# Altium schematic sheet PSAT.SchDoc
size 381 x 241 mm; SheetNumber: 1; SheetTotal: 1
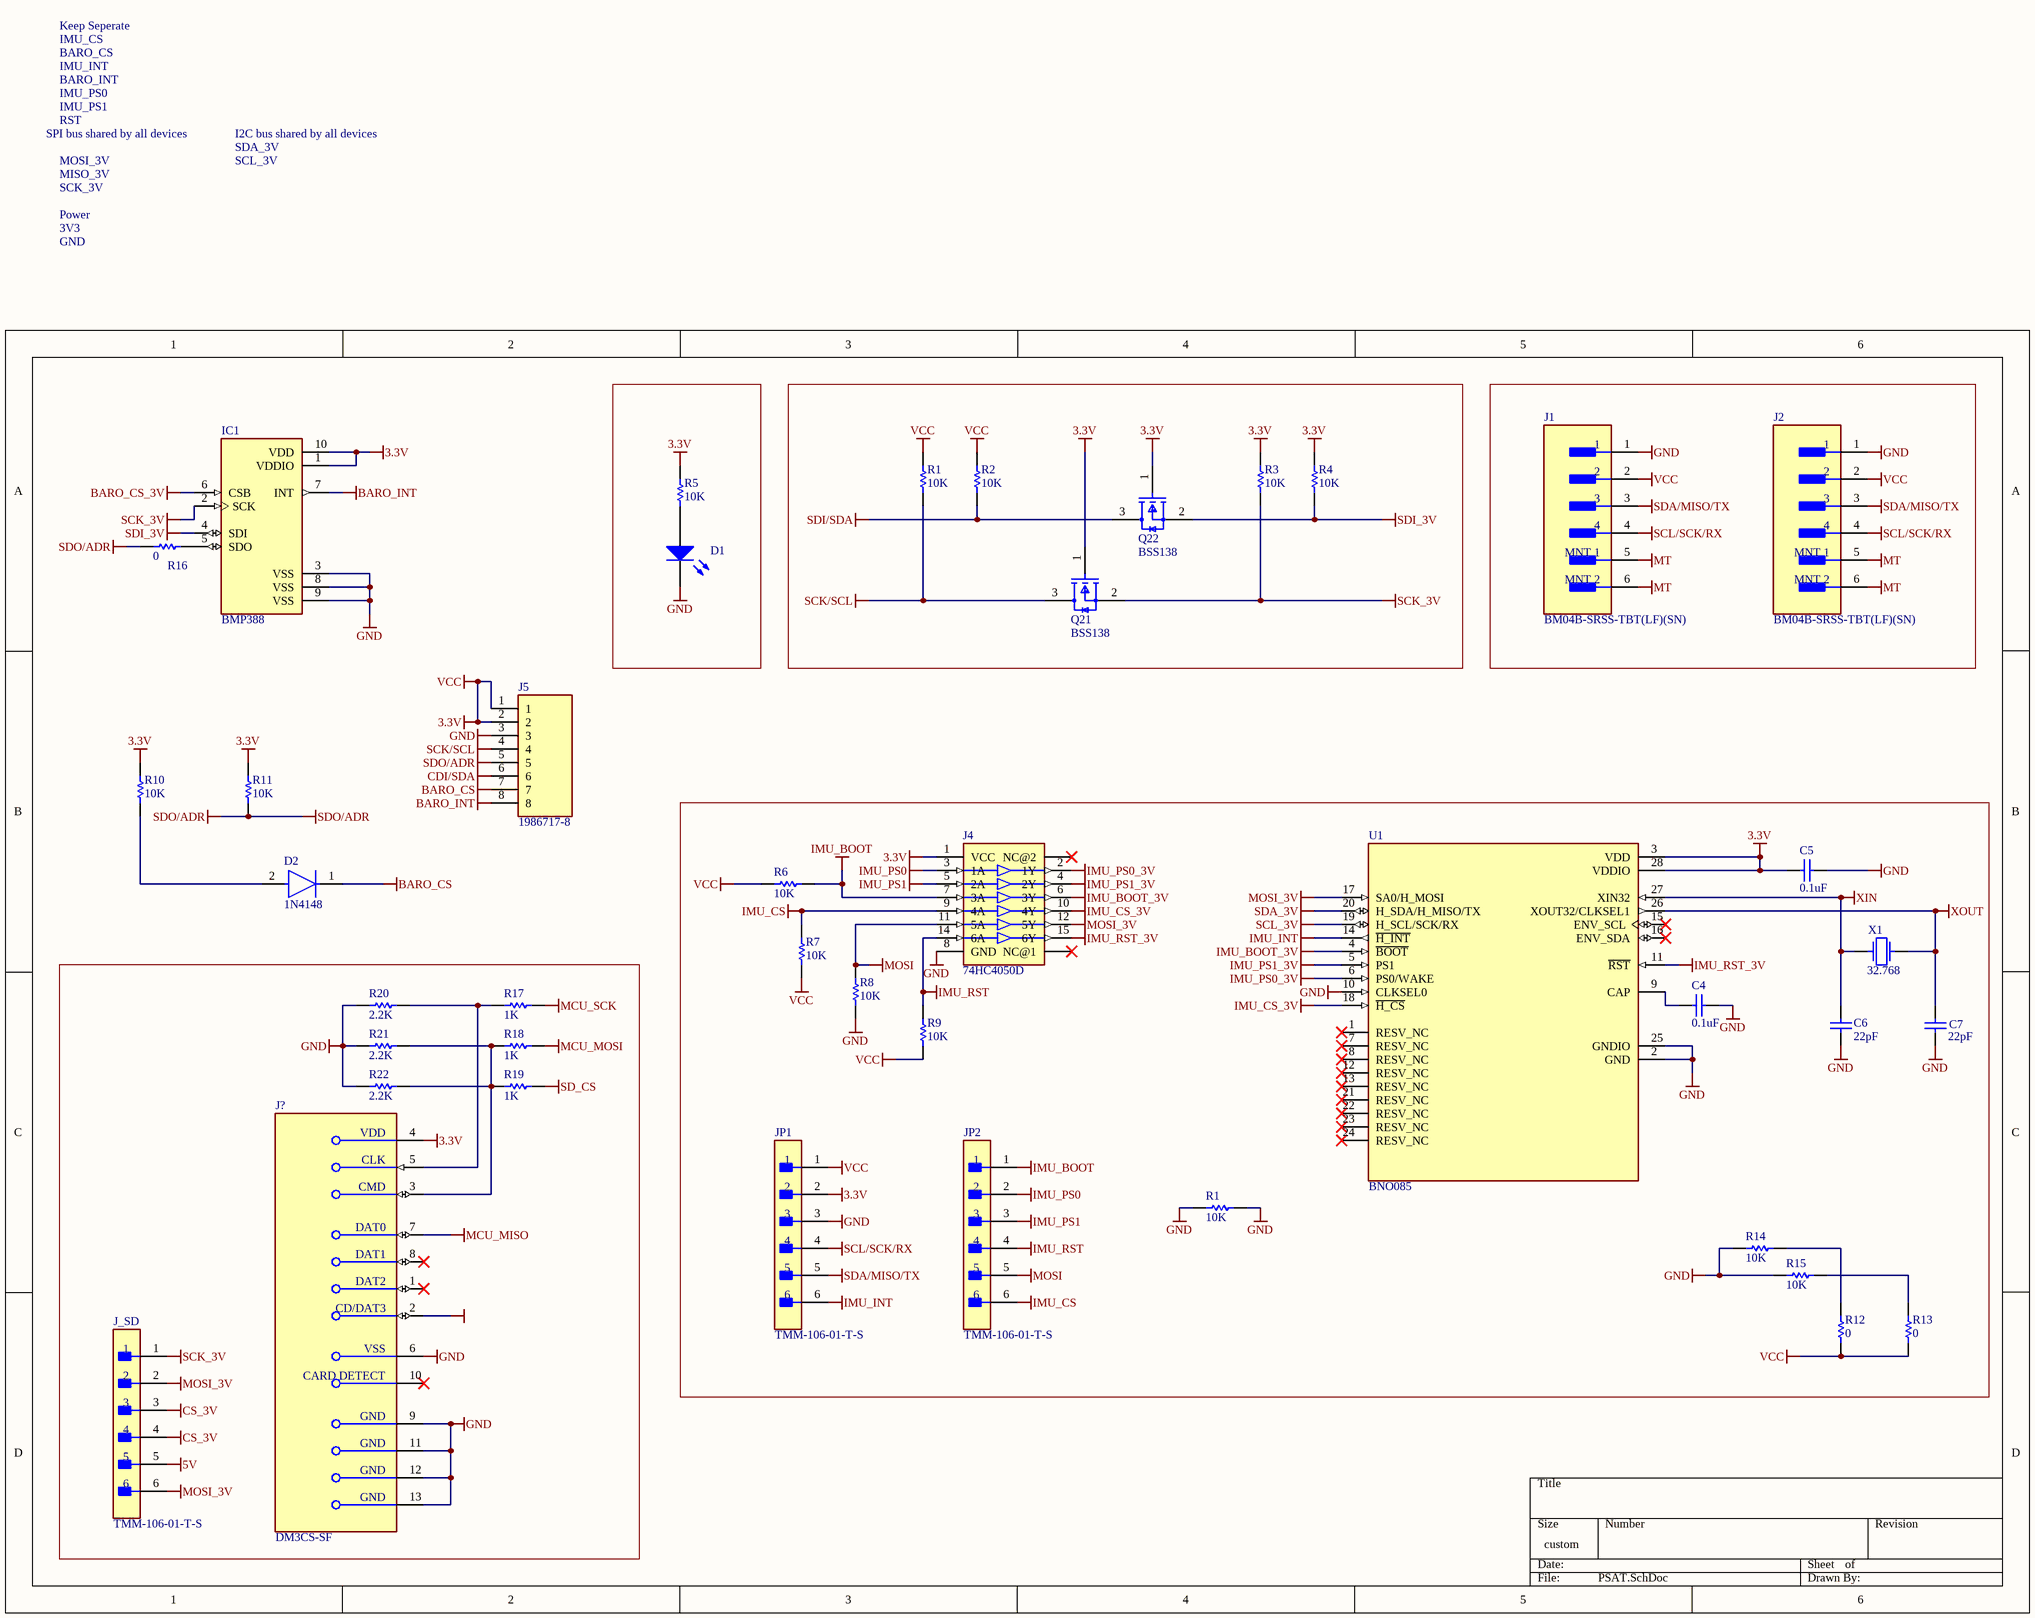
[diagram p0: PSAT.SchDoc]

## Parts
(Parts that share a designator on the sheet are numbered #1, #2 ... from top to bottom, then left to right.)
C4  value 0.1uF  (hidden comment: Capacitor)
C5  C5: 0.1uF  (hidden comment: Capacitor)
C6  C5: 22pF  (hidden comment: Capacitor)
C7  C5: 22pF  (hidden comment: Capacitor)
D1  Light-Emitting Diode  (value not drawn)
D2  1N4148  [FP-017AG-MFG]
IC1  BMP388  [PQFN50P200X200X80-10N]
J1  BM04B-SRSS-TBT(LF)(SN)  [FP-BM04B-SRSS-TBT_LF_SN-MFG]
J2  BM04B-SRSS-TBT(LF)(SN)  [FP-BM04B-SRSS-TBT_LF_SN-MFG]
J4  74HC4050D  [SO16]
J5  1986717-8  [TE_1986717-8]
J?  DM3CS-SF  [FP-DM3CS-SF-MFG]
J_SD  TMM-106-01-T-S  [FP-TMM-106-01-T-S-MFG]
JP1  TMM-106-01-T-S  [FP-TMM-106-01-T-S-MFG]
JP2  TMM-106-01-T-S  [FP-TMM-106-01-T-S-MFG]
Q21  BSS138  [FP-318-08-IPC_B]
Q22  BSS138  [FP-318-08-IPC_B]
R1#1  value 10K  (hidden comment: Resistor)
R1#2  value 10K  (hidden comment: Resistor)
R2  value 10K  (hidden comment: Resistor)
R3  value 10K  (hidden comment: Resistor)
R4  value 10K  (hidden comment: Resistor)
R5  value 10K  (hidden comment: Resistor)
R6  value 10K  (hidden comment: Resistor)
R7  value 10K  (hidden comment: Resistor)
R8  value 10K  (hidden comment: Resistor)
R9  value 10K  (hidden comment: Resistor)
R10  value 10K  (hidden comment: Resistor)
R11  value 10K  (hidden comment: Resistor)
R12  value 0  (hidden comment: Resistor)
R13  value 0  (hidden comment: Resistor)
R14  value 10K  (hidden comment: Resistor)
R15  value 10K  (hidden comment: Resistor)
R16  value 0  (hidden comment: Resistor)
R17  value 1K  (hidden comment: Resistor)
R18  value 1K  (hidden comment: Resistor)
R19  value 1K  (hidden comment: Resistor)
R20  value 2.2K  (hidden comment: Resistor)
R21  value 2.2K  (hidden comment: Resistor)
R22  value 2.2K  (hidden comment: Resistor)
U1  BNO085  [IC_BNO085]
X1  F0: 32.768  (hidden comment: Crystal)

## Nets
3.3V: C5.2 IC1.1(VDDIO) IC1.10(VDD) J1.2 J2.2 J4.1(VCC) J5.1 J5.2 J?.4(VDD) JP1.1 JP1.2 Q21.1(G) Q22.1(G) R1#1.2 R2.2 R3.2 R4.2 R5.2 R6.1 R7.2 R9.2 R10.2 R11.2 R12.1 R13.1 U1.3(VDD) U1.28(VDDIO)  [also labelled VCC]
5V: J_SD.5
BARO_CS: D2.1(C) J5.7
BARO_CS_3V: IC1.6(CSB)
BARO_INT: IC1.7(INT) J5.8
CDI/SDA: J5.6
CS_3V: J_SD.3 J_SD.4
GND: C4.2 C5.1 C6.1 C7.1 D1.2(K) IC1.3(VSS) IC1.8(VSS) IC1.9(VSS) J1.1 J2.1 J4.8(GND) J5.3 J?.6(VSS) J?.9(GND) J?.11(GND) J?.12(GND) J?.13(GND) JP1.3 R1#2.1 R1#2.2 R8.2 R14.2 R15.2 R20.1 R21.1 R22.1 U1.2(GND) U1.10(CLKSEL0) U1.25(GNDIO)
IMU_BOOT: J4.7(3A) JP2.1 R6.2
IMU_BOOT_3V: J4.6(3Y) U1.4(~{BOOT})
IMU_CS: J4.9(4A) JP2.6 R7.1
IMU_CS_3V: J4.10(4Y) U1.18(~{H_CS})
IMU_INT: JP1.6 U1.14(~{H_INT})
IMU_PS0: J4.3(1A) JP2.2
IMU_PS0_3V: J4.2(1Y) U1.6(PS0/WAKE)
IMU_PS1: J4.5(2A) JP2.3
IMU_PS1_3V: J4.4(2Y) U1.5(PS1)
IMU_RST: J4.14(6A) JP2.4 R9.1
IMU_RST_3V: J4.15(6Y) U1.11(~{RST})
MCU_MISO: J?.7(DAT0)
MCU_MOSI: R18.2
MCU_SCK: R17.2
MOSI: J4.11(5A) JP2.5 R8.1
MOSI_3V: J4.12(5Y) J_SD.2 J_SD.6 U1.17(SA0/H_MOSI)
MT: J1.5(MNT_1) J1.6(MNT_2) J2.5(MNT_1) J2.6(MNT_2)
SCK/SCL: J5.4 Q21.3(D) R1#1.1
SCK_3V: IC1.2(SCK) J_SD.1 Q21.2(S) R3.1
SCL/SCK/RX: J1.4 J2.4 JP1.4
SCL_3V: U1.19(H_SCL/SCK/RX)
SD_CS: R19.2
SDA/MISO/TX: J1.3 J2.3 JP1.5
SDA_3V: U1.20(H_SDA/H_MISO/TX)
SDI/SDA: Q22.3(D) R2.1
SDI_3V: IC1.4(SDI) Q22.2(S) R4.1
SDO/ADR: J5.5 R11.1 R16.2
XIN: C6.2 U1.27(XIN32) X1.1
XOUT: C7.2 U1.26(XOUT32/CLKSEL1) X1.2
NetC4_1: C4.1 U1.9(CAP)
NetD1_1: D1.1(A) R5.1
NetD2_2: D2.2(A) R10.1
NetIC1_5: IC1.5(SDO) R16.1
NetJ?_3: J?.3(CMD) R18.1 R19.1 R21.2 R22.2
NetJ?_5: J?.5(CLK) R17.1 R20.2
NetR12_2: R12.2 R14.1
NetR13_2: R13.2 R15.1

Not connected (* = marked no-connect by the designer): J4 13(NC@1)* 16(NC@2)*; J? 1(DAT2)* 2(CD/DAT3) 8(DAT1)* 10(CARD_DETECT)*; U1 1(RESV_NC)* 7(RESV_NC)* 8(RESV_NC)* 12(RESV_NC)* 13(RESV_NC)* 15(ENV_SCL)* 16(ENV_SDA)* 21(RESV_NC)* 22(RESV_NC)* 23(RESV_NC)* 24(RESV_NC)*

## Notes on the sheet
- Keep Seperate
- IMU_CS
- BARO_CS
- IMU_INT
- BARO_INT
- SPI bus shared by all devices
- IMU_PS0
- IMU_PS1
- RST
- I2C bus shared by all devices
- SDA_3V
- Power
- MOSI_3V
- MISO_3V
- SCK_3V
- SCL_3V
- 3V3
- GND

## Library data of the parts
C4-C7 = Capacitor: SimulationGenericComponent: True
D1 = LED: AF: 1; BV: 0; BV_MAX: 1e99; EG: 1.11; FC: 0.5; IBV: 0.001; IS: 1e-14; MJSW: 0.33; NTUN: 30; TNOM: 27; XTI: 3; SimulationGenericComponent: True; CJO: 0; CJP: 0; CTA: 0; CTP: 0; FCS: 0.5; FV_MAX: 1e99; IKF: 0; IKR: 0; ISR: 1e-14; JSW: 0; JTUN: 0; JTUNSW: 0; KEG: 1; KF: 0; LEVEL: 1; N: 1; NBV: 1; NR: 1; NS: 1; PHP: 1; RS: 0; TCV: 0; TLEV: 0; TLEVC: 0; TM1: 0; TM2: 0; TPB: 0; TPHP: 0; TRS: 0; TRS2: 0; TT: 0; TTT1: 0; TTT2: 0; VJ: 1; XTITUN: 3
D2 = CMP-07163-000046-1: DIODE GEN PURP 100V 200MA DO35; Forward Voltage: 1V; Max Power Dissipation: 500mW; Max Reverse Current: 5uA; Forward Current: 300mA; Current: 4A; Reverse Recovery Time: 4ns; Element Configuration: Single; Outside Diameter: 1.85mm; Capacitance: 4pF; Polarity: Standard; Max Forward Surge Current (Ifsm): 1A; Reverse Voltage: 100V; Output Current: 200mA; Average Rectified Current: 200mA; Diameter: 1.91mm; Max Repetitive Reverse Voltage (Vrrm): 100V; Current Rating: 200mA; Case/Package: DO-35; Lead Free: Lead Free; Number of Pins: 2; Recovery Time: 4ns; Packaging: Bulk; Contact Plating: Tin; Voltage: 100V; Mount: Through Hole; Max Surge Current: 4A; Package Quantity: 2000; Width: 1.91mm; Max Reverse Voltage (DC): 100V; Length: 4.56mm; Radiation Hardening: No; Power Dissipation: 500mW; Voltage Rating (DC): 100V; Peak Non-Repetitive Surge Current: 4A; REACH SVHC: No SVHC; Height: 4.56mm; Max Operating Temperature: 175°C; Series: -; Weight: 0.01lb; Min Operating Temperature: -65°C
IC1 = BMP388: P-Sensor SPI I2C 1, 25 Bar SMD; Package: None; Price: None; Value: *; MP: BMP388; Availability: Unavailable
J1 J2 = CMP-17439-000370-1: CONN HEADER SMD 4POS 1MM; Voltage Rating: 50V; Number of Positions: 4; Pitch: 0.039inch; Mated Stacking Heights: 4.9mm; Packaging: Cut Tape; Contact Material: Copper Alloy; Lead Free: Lead Free; Contact Type: Male Pin; Fastening Type: Pull; Connector Type: Header; Contact Finish - Mating: TIN; Series: SR; Number of Rows: 1; Contact Shape: Square; Package Quantity: 1; Color: Natural; Flammability Rating: UL94 V-0; Mount: Surface Mount; Insulation Color: Natural; Termination: Solder; Contact Plating: Tin; Insulation Material: Nylon
J4 = 74HC4050D: Buffer, Non-Inverting 6 Element 1 Bit per Element - Output 16-SOIC; MF: Toshiba; SnapEDA_Link: https://www.snapeda.com/parts/74HC4050D/Toshiba/view-part/?ref=snap; Package: SOIC-16 ON Semiconductor; Value: *; MP: 74HC4050D; Check_prices: https://www.snapeda.com/parts/74HC4050D/Toshiba/view-part/?ref=eda
J5 = 1986717-8: 8 Position Terminal Block Header, Male Pins, Unshrouded 0.138 (3.50mm) Vertical - Through Hole; Number_of_Positions: 8; MF: TE Connectivity; Centerline_Pitch: 3.5 mm[.138 in]; SnapEDA_Link: https://www.snapeda.com/parts/1986717-8/TE+Connectivity+AMP+Connectors/view-part/?ref=snap; Package: None; Value: *; MP: 1986717-8; Check_prices: https://www.snapeda.com/parts/1986717-8/TE+Connectivity+AMP+Connectors/view-part/?ref=eda
J? = CMP-11597-000003-1: CONN MICRO SD CARD HINGED TYPE; Pitch: 1.1mm; Connector Type: Connector; Current Rating: 500mA; Voltage Rating (AC): 125V; Gender: Female; Insulation Resistance: 1GR; Number of Positions: 8; Contact Resistance: 100mR; Packaging: Tape and Reel; Flammability Rating: UL94 V-0; Lead Free: Lead Free; Min Operating Temperature: -25°C; Orientation: Right Angle; Width: 13.8mm; Number of Rows: 1; Housing Material: Polymer; Package Quantity: 1; Mount: Surface Mount; Max Current Rating: 500mA; Radiation Hardening: No; Max Operating Temperature: 85°C; Contact Plating: Gold; Depth: 1.83mm; Contact Material: Gold; Length: 14.1mm; Number of Contacts: 8; Termination: Solder
J_SD JP1 JP2 = CMP-02766-001694-1: CONN HEADER VERT 6POS 2MM; Gender: Male; Max Voltage Rating (AC): 500V; Number of Contacts: 6; Connector Type: Male Pin; Housing Material: Polymer; Max Operating Temperature: 105°C; Termination: Solder; Radiation Hardening: No; Packaging: Bulk; Color: Black; Width: 1.97mm; Housing Color: Black; Lead Free: Lead Free; Depth: 1.97mm; Pitch: 2mm; Length: 12mm; Contact Plating: Tin; Series: FleXYZ™ TMM; Contact Mating Length: 0.126inch; RoHS Compliant: Yes; Contact Material: Bronze; Number of Rows: 1; Min Operating Temperature: -55°C; Mount: Through Hole; Orientation: Straight; Contact Type: Male Pin; Number of Positions: 6; REACH SVHC: No SVHC
Q21 Q22 = CMP-07173-000101-1: MOSFET N-CH 50V 220MA SOT-23; Turn-Off Delay Time: 20ns; Element Configuration: Single; Rds On Max: 3.5R; Gate to Source Voltage (Vgs): 20V; Threshold Voltage: 1.3V; Number of Elements: 1; Power Dissipation: 360mW; Rise Time: 9ns; Turn-On Delay Time: 2.5ns; Input Capacitance: 27pF; On-State Resistance: 6R; Lead Free: Lead Free; Length: 2.92mm; Width: 1.3mm; Drain to Source Breakdown Voltage: 50V; Min Operating Temperature: -55°C; REACH SVHC: No SVHC; Packaging: Tape and Reel; Radiation Hardening: No; Height: 0.93mm; Drain to Source Voltage (Vdss): 50V; Current Rating: 220mA; Voltage Rating (DC): 50V; Weight: 0.03g; Continuous Drain Current (ID): 220mA; Number of Pins: 3; Nominal Vgs: 1.3V; Max Power Dissipation: 360mW; Fall Time: 9ns; Drain to Source Resistance: 3.5R; Contact Plating: Tin; Case/Package: SOT-23; Package Quantity: 1; Dual Supply Voltage: 50V; Mount: Surface Mount; Termination: SMD/SMT; Max Operating Temperature: 150°C
R1#1 R1#2 R2-R11 R14 R15 R17-R22 = Resistor: TC1: 0; SimulationGenericComponent: True; TC2: 0
R12 R13 R16 = Resistor: SimulationGenericComponent: True; TC1: 0; TC2: 0
U1 = BNO085: Accelerometer, Gyroscope, Magnetometer, 9 Axis Sensor IÂ²C, SPI, UART Output; MF: Hillcrest Laboratories,; SnapEDA_Link: https://www.snapeda.com/parts/BNO085/Hillcrest+Laboratories%252C+Inc./view-part/?ref=snap; Package: TFLGA-28 Hillcrest Laboratories; Value: *; MP: BNO085; Check_prices: https://www.snapeda.com/parts/BNO085/Hillcrest+Laboratories%252C+Inc./view-part/?ref=eda
X1 = Crystal: R: 500; Q: 50K; SimulationGenericComponent: True